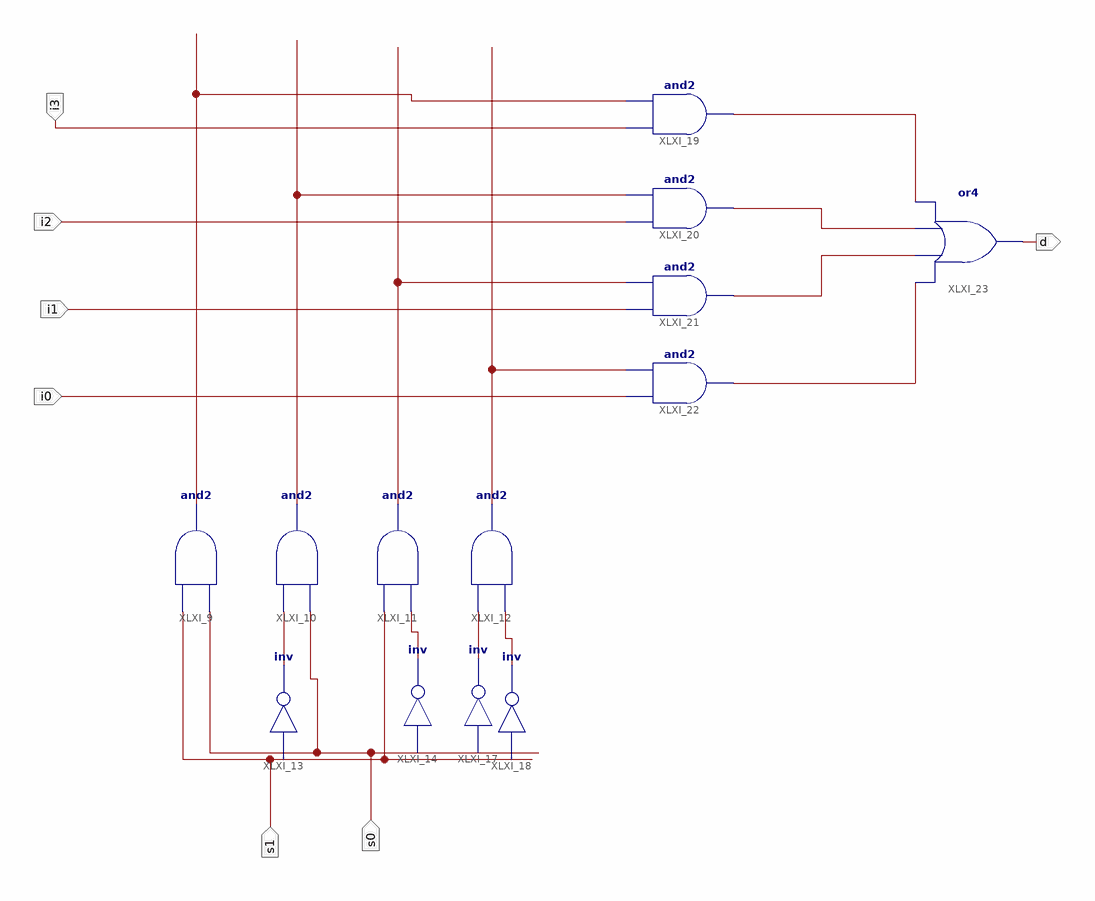
[diagram p0: schematic sheet 1]
// Xilinx ISE schematic mux_schem.sch (spartan3e) as structural Verilog: 13 symbols, 7 ports
module mux_schem (
  input  s1,
  input  s0,
  input  i3,
  input  i2,
  input  i1,
  input  i0,
  output d
);

  wire XLXN_7, XLXN_10, XLXN_11, XLXN_12, XLXN_13, XLXN_14, XLXN_15, XLXN_16, XLXN_21, XLXN_22, XLXN_23,
       XLXN_24;

  and XLXI_9 (XLXN_21, s0, s1);
  and XLXI_10 (XLXN_22, s0, XLXN_7);
  and XLXI_11 (XLXN_23, XLXN_10, s1);
  and XLXI_12 (XLXN_24, XLXN_12, XLXN_11);
  not XLXI_13 (XLXN_7, s1);
  not XLXI_14 (XLXN_10, s0);
  not XLXI_17 (XLXN_11, s0);
  not XLXI_18 (XLXN_12, s1);
  and XLXI_19 (XLXN_13, i3, XLXN_21);
  and XLXI_20 (XLXN_14, i2, XLXN_22);
  and XLXI_21 (XLXN_15, i1, XLXN_23);
  and XLXI_22 (XLXN_16, i0, XLXN_24);
  or XLXI_23 (d, XLXN_16, XLXN_15, XLXN_14, XLXN_13);
endmodule
